# EAGLE design differential_ac_coupled (EAGLE 6.5.0)
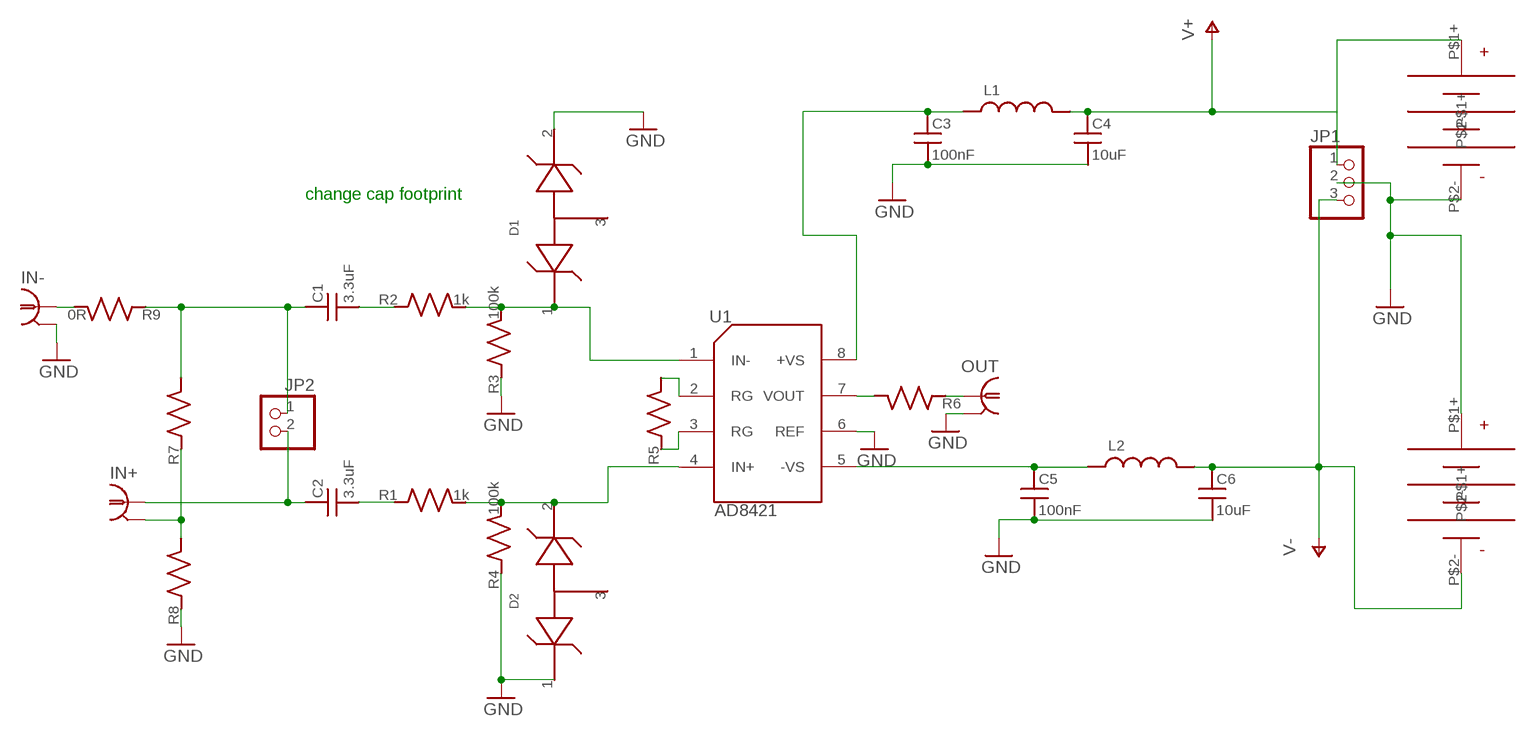
[diagram p0: schematic, sheet 1]

## Parts
C1  3.3uF  C_MLCC_SMDCMLCC_JLEAD  [CKG-JLEAD]
C2  3.3uF  C_MLCC_SMDCMLCC_JLEAD  [CKG-JLEAD]
C3  100nF  C_MLCC_SMDCMLCC_0603  [C_MLCC_0603]
C4  10uF  C_MLCC_SMDCMLCC_0805  [C_MLCC_0805]
C5  100nF  C_MLCC_SMDCMLCC_0603  [C_MLCC_0603]
C6  10uF  C_MLCC_SMDCMLCC_0805  [C_MLCC_0805]
D1  ZENER-DUAL  [SOT-23]
D2  ZENER-DUAL  [SOT-23]
IN+  BNC-H  [BNC90]
IN-  BNC-H  [BNC90]
JP1  PINHD-1X3  [1X03]
JP2  SCRWTRM-1X2/90_ED550  [1X02_RA_SCRWTRM_ED550]
L1  L_FERRITE_SMDLFERRITE_0603  [L_FERRITE_0603]
L2  L_FERRITE_SMDLFERRITE_0603  [L_FERRITE_0603]
OUT  BNC-H  [BNC90]
R1  1k  R_SMDR1206  [R_1206]
R2  1k  R_SMDR1206  [R_1206]
R3  100k  R_SMDR1206  [R_1206]
R4  100k  R_SMDR1206  [R_1206]
R5  R_SMDR0603  [R_0603]
R6  R_SMDR0603  [R_0603]
R7  R_SMDR1206  [R_1206]
R8  R_SMDR1206  [R_1206]
R9  0R  R_SMDR1206  [R_1206]
U1  AD8421  [SOIC-8]
U$1  BATT-HOLDER  [BH23A-BATT-HOLDER]
U$2  BATT-HOLDER  [BH23A-BATT-HOLDER]

## Nets
GND: C3.P$2 C4.P$2 C5.P$2 C6.P$2 D1.2 D2.1 IN-.2 JP1.2 OUT.2 R3.P$1 R4.P$1 R8.P$1 U1.6(REF) U$1.P$2- U$2.P$1+
N$1: C1.P$2 R2.P$1
N$2: C2.P$2 R1.P$1
N$3: D2.2 R1.P$2 R4.P$2 U1.4(IN+)
N$4: D1.1 R2.P$2 R3.P$2 U1.1(IN-)
N$5: OUT.1 R6.P$1
N$6: C3.P$1 L1.P$1 U1.8(+VS)
N$7: R5.P$2 U1.2(RG)
N$8: R5.P$1 U1.3(RG)
N$9: C5.P$1 L2.P$1 U1.5(-VS)
N$10: R6.P$2 U1.7(VOUT)
N$11: C2.P$1 IN+.1 JP2.2
N$12: C1.P$1 JP2.1 R7.P$2 R9.P$1
N$13: IN-.1 R9.P$2
N$14: IN+.2 R7.P$1 R8.P$2
V+: C4.P$1 JP1.1 L1.P$2 U$1.P$1+
V-: C6.P$1 JP1.3 L2.P$2 U$2.P$2-
Unconnected: D1.3 D2.3

## Notes on the sheet
- change cap footprint

## Library data of the parts
C1-C6 = jqi_passives:C_MLCC_SMD
D1 D2 = semiconductor-jqi:ZENER-DUAL
IN+ IN- OUT = connector-jqi:BNC: BNC Connector.; DIGIKEY: A32260-ND
JP1 = pinhead:PINHD-1X3: PIN HEADER
JP2 = Lin-Temp-Controller:SCRWTRM-1X2: Screw Terminal; DIGIKEY: ED1501-ND; MFR_PN: ED550/2DS
L1 L2 = jqi_passives:L_FERRITE_SMD
R1-R9 = jqi_passives:R_SMD
U1 = pchvd:AD8421
U$1 U$2 = regulator-jqi:BATT-HOLDER; DIGIKEY: BH23APC-ND

## Board
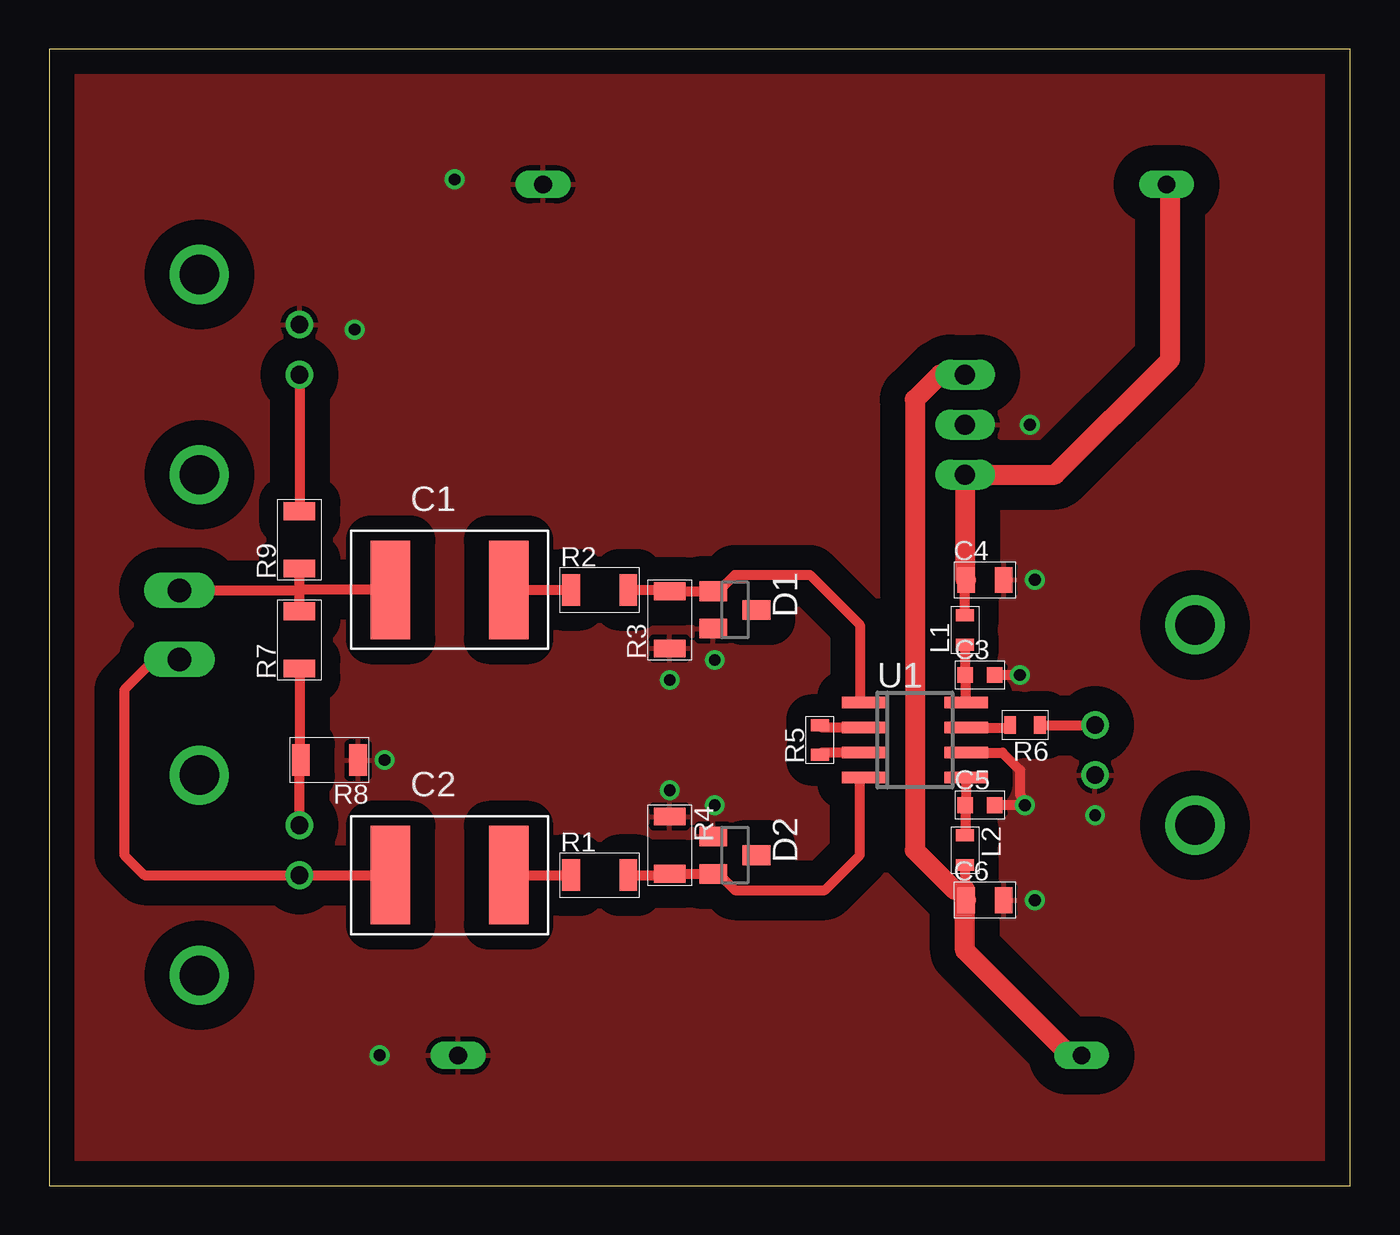
[diagram p1: board, top side]
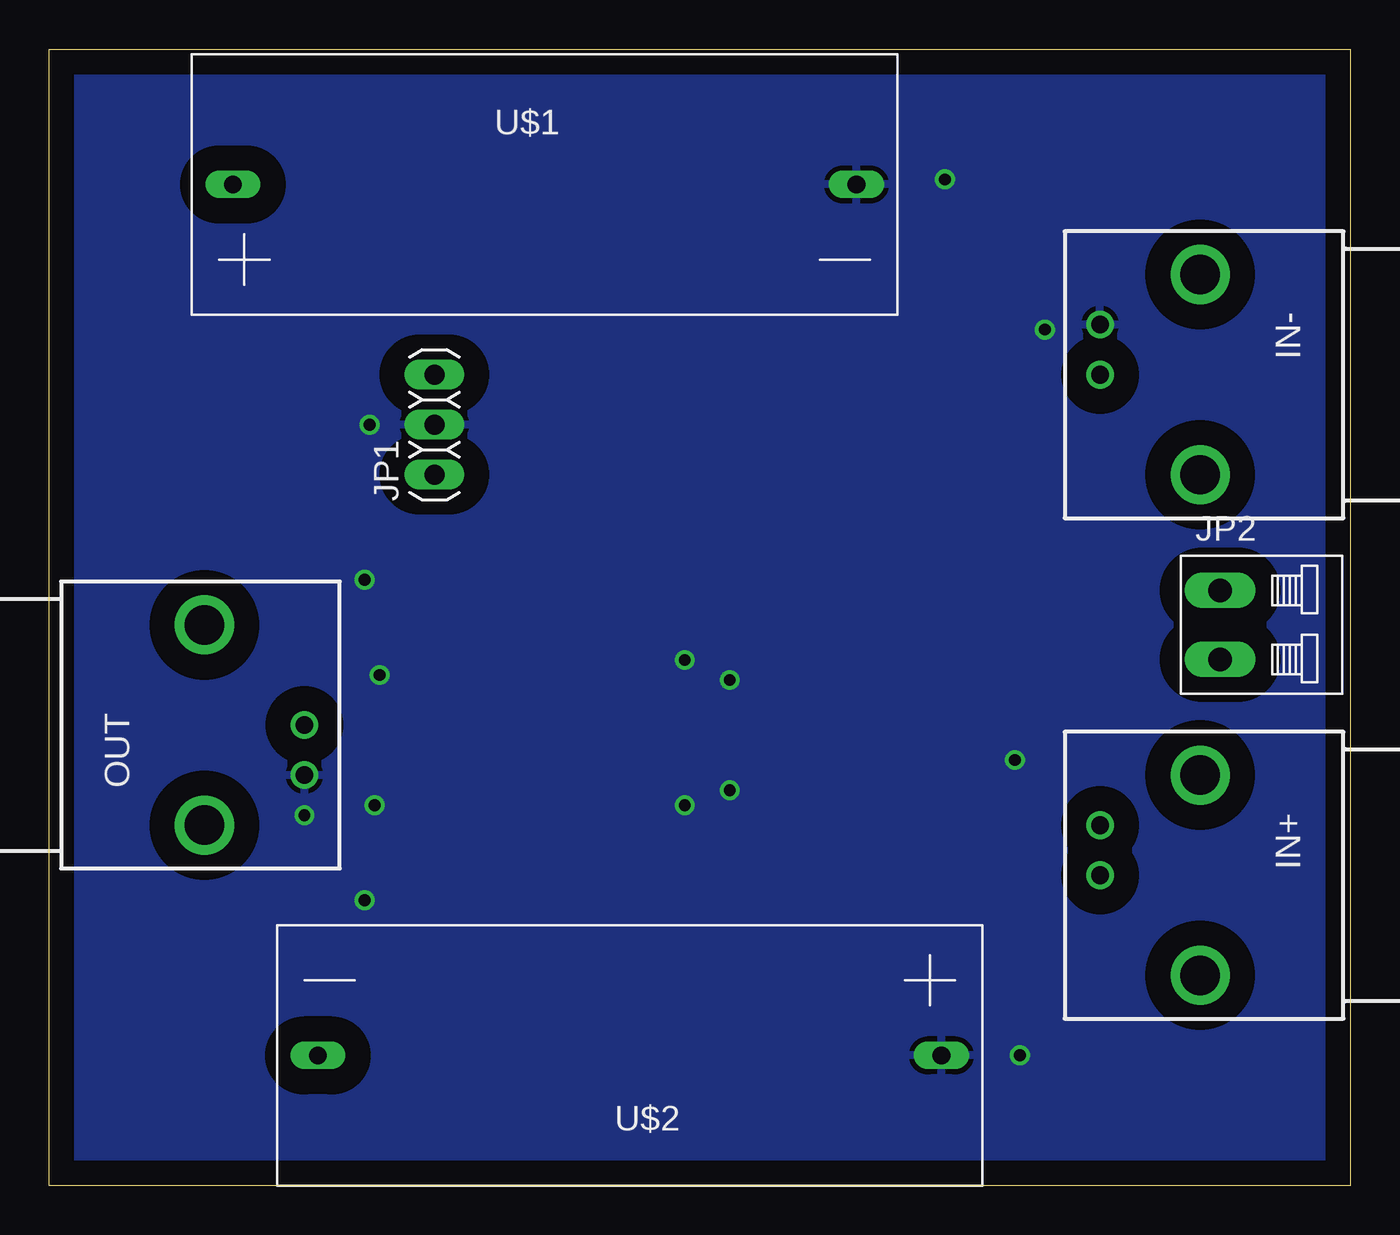
[diagram p2: board, bottom side, seen from below]

Size 66.04 x 57.66 mm. Coordinates in mm from the lower left corner, seen from the top.
Outline: 0,57.66 0,0 66.04,0 66.04,57.66 0,57.66
Copper layers (1*16): Top 0.035mm / dielectric 1.5mm / Bottom 0.035mm
Design rules "default": minimum track width 10mil, minimum drill 24mil, track to track 8mil, track to pad 8mil, pad to pad 8mil, via to via 8mil, smd to smd 8mil, copper to edge 40mil, drill to drill 8mil, minimum pad ring 10mil, minimum via ring 8mil, stop-mask expansion 4mil, vias tented up to drill 0mil, thermal gap 10mil

### Footprints (pad centres in the part's own frame; a part is rotated, then mirrored left to right if it is on the bottom)
CKG-JLEAD = smd 2 x 5: P$1 -3,0; P$2 3,0
C_MLCC_0603 = smd 0.8 x 0.8: P$1 -0.75,0; P$2 0.75,0
C_MLCC_0805 = smd 0.9 x 1.3: P$1 -0.95,0; P$2 0.95,0
SOT-23 = smd 1 x 1.4: 1 -0.95,-1.1; 2 0.95,-1.1; 3 0,1.1
BNC90 = drill 0.9 pad 1.27: 1 0,-5.08; 2 -2.54,-5.08 | drill 2 pad 2.032: ANCHOR1 -5.08,0; ANCHOR2 5.08,0
1X03 = drill 1.016 long: 1 -2.54,0; 2 0,0; 3 2.54,0
1X02_RA_SCRWTRM_ED550 = drill 1.2 long: 1 -1.75,0; 2 1.75,0
L_FERRITE_0603 = smd 0.6 x 0.9: P$1 -0.75,0; P$2 0.75,0
R_1206 = smd 0.9 x 1.6: P$1 -1.45,0; P$2 1.45,0
R_0603 = smd 0.6 x 0.9: P$1 -0.75,0; P$2 0.75,0
SOIC-8 = smd 0.6 x 2.2: 1 -1.905,-2.6; 2 -0.635,-2.6; 3 0.635,-2.6; 4 1.905,-2.6; 5 1.905,2.6; 6 0.635,2.6; 7 -0.635,2.6; 8 -1.905,2.6
BH23A-BATT-HOLDER = drill 0.9 long: P$1+ -15.824,0; P$2- 15.824,0

### Placement (x,y rotation side)
C1  20.32,30.23 0 top
C2  20.32,15.75 0 top
C3  47.24,25.91 0 top
C4  47.5,30.73 0 top
C5  47.24,19.3 0 top
C6  47.5,14.48 0 top
D1  34.8,29.21 270 top
D2  34.8,16.76 270 top
IN+  7.62,15.75 270 bottom
IN-  7.62,41.15 270 bottom
JP1  46.48,38.61 90 bottom
JP2  6.6,28.45 270 bottom
L1  46.48,28.19 90 top
L2  46.48,17.02 270 top
OUT  58.17,23.37 90 bottom
R1  27.94,15.75 0 top
R2  27.94,30.23 0 top
R3  31.5,28.7 90 top
R4  31.5,17.27 270 top
R5  39.12,22.61 90 top
R6  49.53,23.37 180 top
R7  12.7,27.69 90 top
R8  14.22,21.59 180 top
R9  12.7,32.77 90 top
U1  43.94,22.61 270 top
U$1  40.89,50.8 0 bottom
U$2  36.58,6.6 180 bottom

### Tracks (layer width: path | path; a pad name or v marks a point on that pad's centre or on a via)
GND  (via drill 0.6)
  Top 0.508: U1.6 48.39,21.97 49.28,21.08 49.28,19.81 49.78,19.3 v49.53,19.3 C5.P$2 | C3.P$2 v49.28,25.91
  other vias: 50.04,30.73 33.78,26.67 31.5,25.65 33.78,19.3 31.5,20.07 50.04,14.48 53.09,18.8 49.78,38.61 17.02,21.59 15.49,43.43 20.57,51.05 16.76,6.6
  pour Top (isolate 1.27): 0,58.17 66.04,58.17 66.04,-1.78 0,-1.78
  pour Bottom (isolate 1.27): 0,58.17 66.04,58.17 66.04,-1.78 0,-1.78
N$1
  Top 0.508: C1.P$2 R2.P$1
N$2
  Top 0.508: C2.P$2 R1.P$1
N$3
  Top 0.508: R1.P$2 31.42,15.75 R4.P$2 D2.2 33.97,15.81 34.8,14.99 39.37,14.99 41.15,16.76 41.15,20.51 U1.4
N$4
  Top 0.508: R2.P$2 31.42,30.23 R3.P$2 D1.1 33.97,30.16 34.8,30.99 38.61,30.99 41.15,28.45 41.15,24.71 U1.1
N$5
  Top 0.508: R6.P$1 OUT.1
N$6
  Top 0.508: U1.8 46.54,25.86 C3.P$1 46.49,27.43 L1.P$1
N$7
  Top 0.508: U1.2 39.23,23.24 R5.P$2
N$8
  Top 0.508: U1.3 39.23,21.97 R5.P$1
N$9
  Top 0.508: U1.5 46.54,19.35 C5.P$1 46.49,17.78 L2.P$1
N$10
  Top 0.508: U1.7 48.65,23.24 R6.P$2
N$11
  Top 0.508: C2.P$1 IN+.1 4.83,15.75 3.81,16.76 3.81,25.15 5.36,26.7 JP2.2
N$12
  Top 0.508: C1.P$1 12.7,30.23 | 12.7,30.23 R9.P$1 | R7.P$2 12.7,30.23 | JP2.1 12.67,30.2 12.7,30.23
N$13
  Top 0.508: IN-.1 R9.P$2
N$14
  Top 0.508: R7.P$1 12.7,21.66 R8.P$2 12.7,21.52 IN+.2
V+
  Top 0.508: L1.P$2 46.48,30.67 C4.P$1
  Top 1.016: C4.P$1 46.48,30.8 JP1.1 51.05,36.07 56.9,41.91 56.9,50.62 U$1.P$1+
V-
  Top 0.508: L2.P$2 46.48,14.99 46.48,14.54 C6.P$1
  Top 1.016: 46.48,14.99 45.97,14.99 43.94,17.02 43.94,39.88 45.21,41.15 JP1.3 | U$2.P$2- 51.82,6.6 46.48,11.94 46.48,14.41 C6.P$1